# Altium schematic sheet power.SchDoc
size A
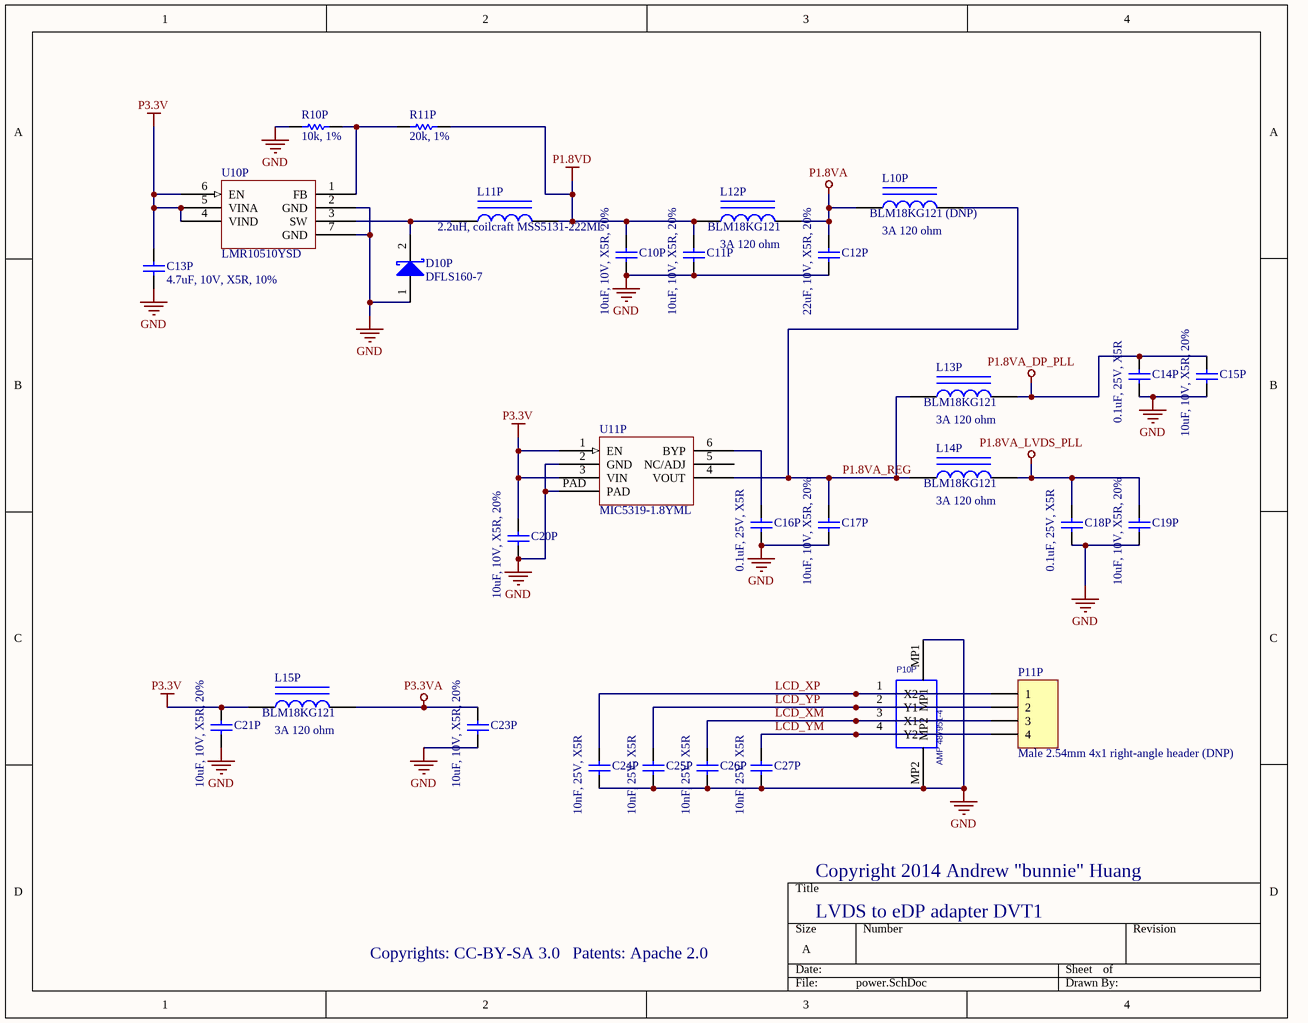
[diagram p0: power.SchDoc]

## Parts
C10P  10uF, 10V, X5R, 20%  [CAPC1608N]
C11P  10uF, 10V, X5R, 20%  [CAPC1608N]
C12P  22uF, 10V, X5R, 20%  [CAPC2012N]
C13P  4.7uF, 10V, X5R, 10%  [CAPC1608N]
C14P  0.1uF, 25V, X5R  [CAPC1005N]
C15P  10uF, 10V, X5R, 20%  [CAPC1608N]
C16P  0.1uF, 25V, X5R  [CAPC1005N]
C17P  10uF, 10V, X5R, 20%  [CAPC1608N]
C18P  0.1uF, 25V, X5R  [CAPC1005N]
C19P  10uF, 10V, X5R, 20%  [CAPC1608N]
C20P  10uF, 10V, X5R, 20%  [CAPC1608N]
C21P  10uF, 10V, X5R, 20%  [CAPC1608N]
C23P  10uF, 10V, X5R, 20%  [CAPC1608N]
C24P  10nF, 25V, X5R  [CAPC1005N]
C25P  10nF, 25V, X5R  [CAPC1005N]
C26P  10nF, 25V, X5R  [CAPC1005N]
C27P  10nF, 25V, X5R  [CAPC1005N]
D10P  DFLS160-7  [POWERDI-123]
L10P  BLM18KG121 (DNP)  value 3A 120 ohm  [INDC1608AN]
L11P  2.2uH, coilcraft MSS5131-222ML  [COILCRAFT_MSS5121]
L12P  BLM18KG121  value 3A 120 ohm  [INDC1608AN]
L13P  BLM18KG121  value 3A 120 ohm  [INDC1608AN]
L14P  BLM18KG121  value 3A 120 ohm  [INDC1608AN]
L15P  BLM18KG121  value 3A 120 ohm  [INDC1608AN]
P10P  AMP 487951-4  [AMP_487951_4]
P11P  Male 2.54mm 4x1 right-angle header (DNP)  [HDR1X4H]
R10P  10k, 1%  [RESC1005N]
R11P  20k, 1%  [RESC1005N]
U10P  LMR10510YSD  [SON95P300X300X80-7V]
U11P  MIC5319-1.8YML  [MICREL_MLF2x2_6]

## Nets
GND: C10P.1 C11P.1 C12P.2 C13P.2 C14P.1 C15P.1 C16P.1 C17P.1 C18P.1 C19P.1 C20P.1 C21P.1 C23P.1 C24P.1 C25P.1 C26P.1 C27P.1 D10P.1(A) P10P.MP1 P10P.MP2 R10P.2 U10P.2(GND) U10P.7(GND) U11P.2(GND) U11P.PAD
P1.8VA: C12P.1 L10P.1 L12P.2
P1.8VA_DP_PLL: C14P.2 C15P.2 L13P.2
P1.8VA_LVDS_PLL: C18P.2 C19P.2 L14P.2
P1.8VD: C10P.2 C11P.2 L11P.2 L12P.1 R11P.1
P3.3V: C13P.1 C20P.2 C21P.2 L15P.1 U10P.4(VIND) U10P.5(VINA) U10P.6(EN) U11P.1(EN) U11P.3(VIN)
P3.3VA: C23P.2 L15P.2
LCD_XM: C26P.2 P10P.3(X1) P11P.3
LCD_XP: C24P.2 P10P.1(X2) P11P.1
LCD_YM: C27P.2 P10P.4(Y2) P11P.4
LCD_YP: C25P.2 P10P.2(Y1) P11P.2
P1.8VA_REG: C17P.2 L10P.2 L13P.1 L14P.1 U11P.4(VOUT)
NetC16P_2: C16P.2 U11P.6(BYP)
NetD10P_2: D10P.2(K) L11P.1 U10P.3(SW)
NetR10P_1: R10P.1 R11P.2 U10P.1(FB)

Not connected (* = marked no-connect by the designer): U11P 5(NC/ADJ)

## Notes on the sheet
- Copyright 2014 Andrew "bunnie" Huang
- Copyrights: CC-BY-SA 3.0
- Patents: Apache 2.0
- LVDS to eDP adapter DVT1

## Library data of the parts
C10P C11P C12P C13P C14P C15P C16P C17P C18P C19P C20P C21P C23P C24P C25P C26P C27P = Cap Semi: Capacitor (Semiconductor SIM Model); Published: 8-Jun-2000; LatestRevisionDate: 17-Jul-2002; LatestRevisionNote: Re-released for DXP Platform.; PackageReference: C1206; Publisher: Altium Limited
D10P = D Schottky: Schottky Diode; Code - JEDEC: DO-214-AA; Published: 8-Jun-2000; Publisher: Altium Limited; Revision: July-2002: Re-released for DXP Platform.
L10P L11P L12P L13P L14P L15P = Inductor Iron: Magnetic-Core Inductor; Published: 24-Mar-1999; LatestRevisionDate: 17-Jul-2002; LatestRevisionNote: Re-released for DXP Platform.; PackageReference: AXIAL-0.9; Publisher: Altium Limited
P10P = TFT_TP_CON: Right: 30; Bottom: 50
P11P = Header 4H: Header, 4-Pin, Right Angle; LatestRevisionDate: 17-Jul-2002; LatestRevisionNote: Re-released for DXP Platform.; Publisher: Altium Limited
R10P R11P = Res1: Resistor; Value: 100k; Published: 8-Jun-2000; LatestRevisionDate: 17-Jul-2002; LatestRevisionNote: Re-released for DXP Platform.; PackageReference: AXIAL-0.3; Publisher: Altium Limited
U10P = LMR10515XSD: NatSemi 1.5A step-down regulator in LLP
U11P = MIC5319-XXYML: 500 mA uCap ultra-low dropout high PSRR LDO regulator